# Altium schematic sheet highpass-filter-conditioning.SchDoc: SD Input Highpass
size A4; DrawnBy: Dylan Vogel; Organization: UTAT SS; DocumentNumber: 9; Revision: 2; SheetNumber: 9; SheetTotal: 13
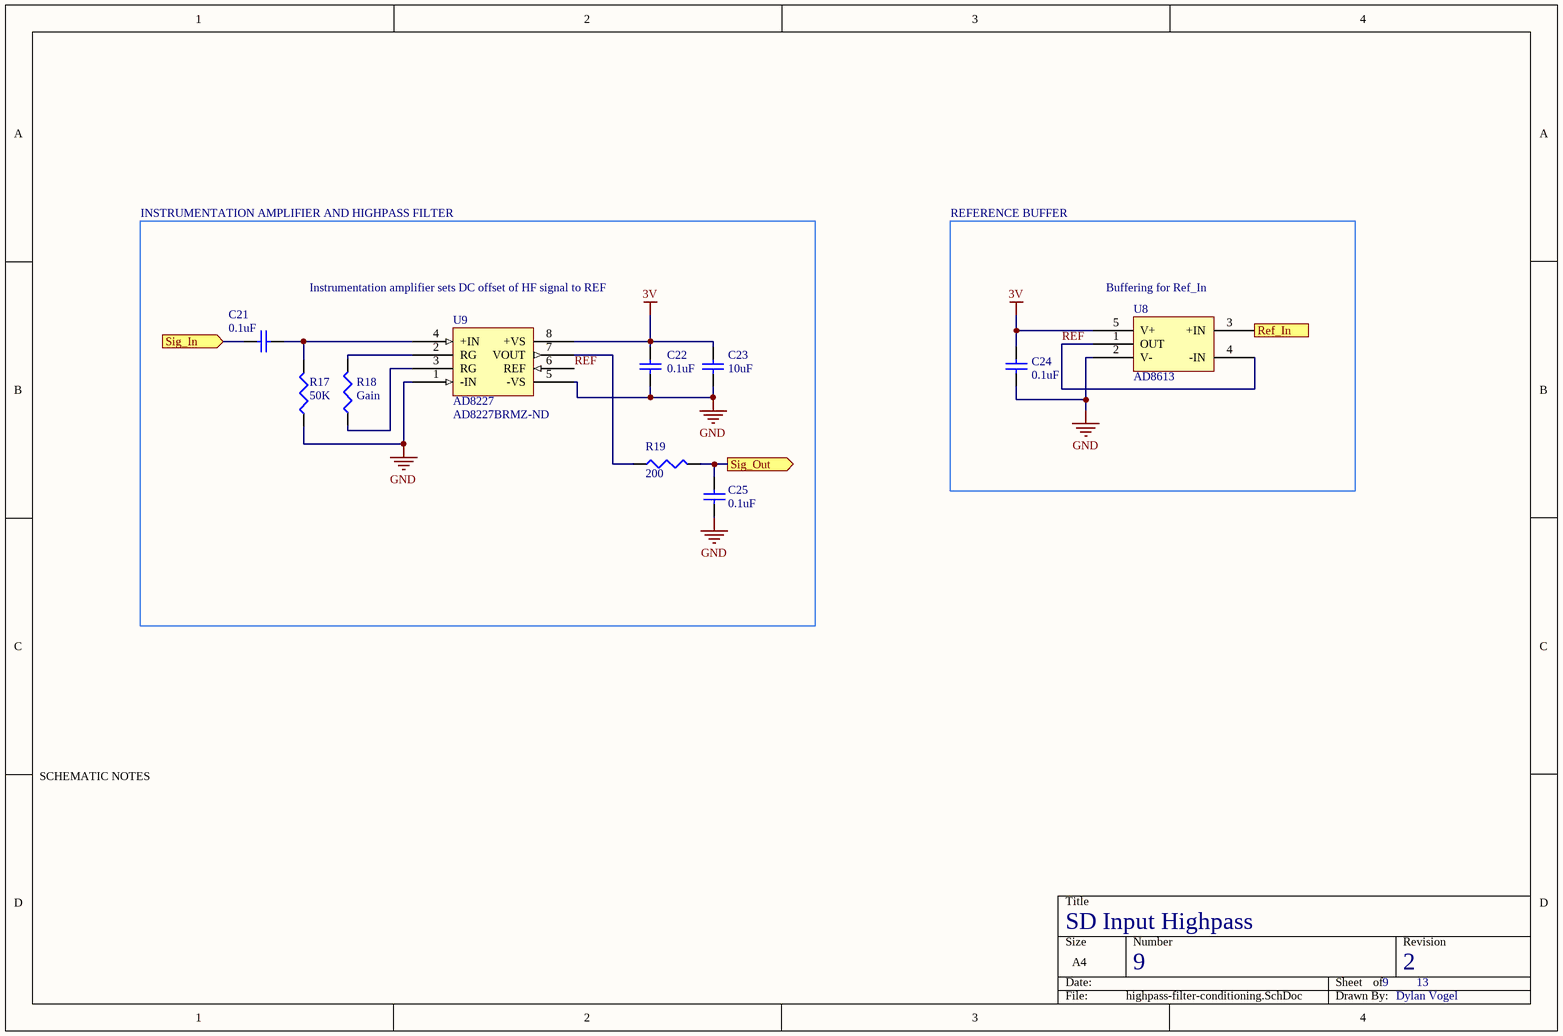
[diagram p0: highpass-filter-conditioning.SchDoc]

## Parts
C21  0.1uF  [0402]
C22  0.1uF  [0402]
C23  10uF  [1608[0603]]
C24  0.1uF  [0402]
C25  0.1uF  [0402]
R17  50K  [0402]
R18  Gain  [0402]
R19  200  [0402]
U8  AD8613  [SOP-65P200X125-5N]
U9  AD8227  Supplier Part Number 1: AD8227BRMZ-ND  [SOP8-65P300X300-8N]

## Ports
Ref_In (in), Sig_In (in), Sig_Out (out)

## Nets
3V: C22.2 C23.2 C24.2 U8.5(V+) U9.8(+VS)
GND: C22.1 C23.1 C24.1 C25.1 R17.1 U8.2(V-) U9.1(-IN) U9.5(-VS)
REF: U8.1(OUT) U8.4(-IN) U9.6(REF)
Ref_In: U8.3(+IN) ; port Ref_In
Sig_In: C21.2 ; port Sig_In
Sig_Out: C25.2 R19.2 ; port Sig_Out
NetC21_1: C21.1 R17.2 U9.4(+IN)
NetR18_1: R18.1 U9.3(RG)
NetR18_2: R18.2 U9.2(RG)
NetR19_1: R19.1 U9.7(VOUT)

## Notes on the sheet
- INSTRUMENTATION AMPLIFIER AND HIGHPASS FILTER
- REFERENCE BUFFER
- Instrumentation amplifier sets DC offset of HF signal to REF
- (near U8) Buffering for Ref_In
- Cut-off frequency is 32 Hz, minimal effect on phase of 500 Hz signal. AC coupling for instrumentation amplifier input.
- No resistor on RG sets 5x gain on amplifier.
- SCHEMATIC NOTES

## Library data of the parts
C21-C25 = Cap Semi: Capacitor (Semiconductor SIM Model); Published: 8-Jun-2000; LatestRevisionDate: 29-May-2009; LatestRevisionNote: IPC-7351 Footprint Added.; PackageReference: C1206; Publisher: Altium Limited; PackageDescription: Chip Capacitor; Supplier: Digi-Key; Supplier 1: Digi-Key
  C21 C22 C24 C25: Value: 0.1uF
  C23: Value: 10uF
R17 R19 = Res3: Resistor; Published: 8-Jun-2000; LatestRevisionDate: 29-May-2009; LatestRevisionNote: IPC-7351 Footprint Added.; PackageReference: J1-0603; Publisher: Altium Limited; PackageDescription: Chip Resistor; Supplier: Digi-Key; Supplier 1: Digi-Key
  R17: Value: 50K
  R19: Value: 200
R18 = Res3: Optional resistor sets instrumentation amplifier gain; Published: 8-Jun-2000; LatestRevisionDate: 29-May-2009; LatestRevisionNote: IPC-7351 Footprint Added.; PackageReference: J1-0603; Publisher: Altium Limited; PackageDescription: Chip Resistor; Supplier 1: Digi-Key
U8 = AD8613: Low power, low noise rail-to-rail op-amp.; Supplier: Digi-Key; Supplier 1: Digi-Key
U9 = AD8227: Rail-to-rail instrumentation amplifier. Can operate on single supply.; Supplier 1: Digi-Key; Supplier: Digi-Key